# Altium project SteeringCircuit.PrjPcb
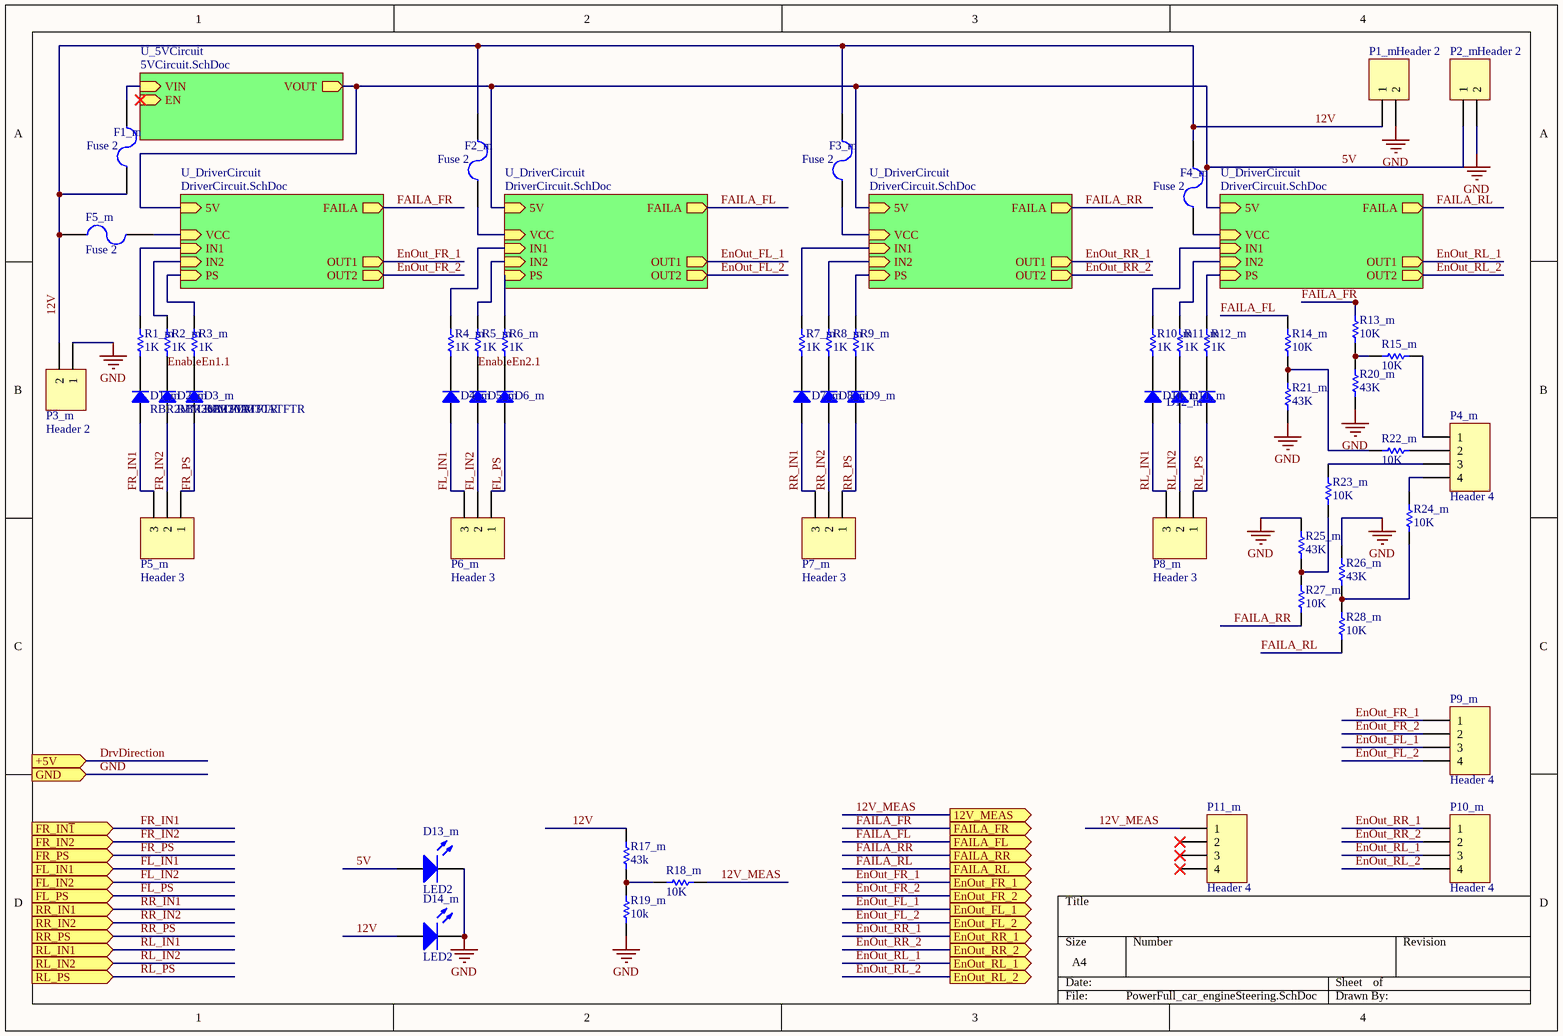
[diagram p0: PowerFull_car_engineSteering.SchDoc]
3 sheets, 93 parts. Net scope: hierarchical (ports join the sheet entries above them; power ports are global).
Board file: PCB.PcbDoc
Sheets:
  PowerFull_car_engineSteering.SchDoc
    U_DriverCircuit = DriverCircuit.SchDoc
    U_5VCircuit = 5VCircuit.SchDoc
    U_DriverCircuit = DriverCircuit.SchDoc
    U_DriverCircuit = DriverCircuit.SchDoc
    U_DriverCircuit = DriverCircuit.SchDoc

## Sheet PowerFull_car_engineSteering.SchDoc
size A4

### Parts
D1_m  RBR2MM30ATFTR  [SOD123F]
D2_m  RBR2MM30ATFTR  [SOD123F]
D3_m  RBR2MM30ATFTR  [SOD123F]
D4_m  RBR2MM30ATFTR  [SOD123F]  (value not drawn)
D5_m  RBR2MM30ATFTR  [SOD123F]  (value not drawn)
D6_m  RBR2MM30ATFTR  [SOD123F]  (value not drawn)
D7_m  RBR2MM30ATFTR  [SOD123F]  (value not drawn)
D8_m  RBR2MM30ATFTR  [SOD123F]  (value not drawn)
D9_m  RBR2MM30ATFTR  [SOD123F]  (value not drawn)
D10_m  RBR2MM30ATFTR  [SOD123F]  (value not drawn)
D11_m  RBR2MM30ATFTR  [SOD123F]  (value not drawn)
D12_m  RBR2MM30ATFTR  [SOD123F]  (value not drawn)
D13_m  LED2  [1608[0603]]
D14_m  LED2  [1608[0603]]
F1_m  Fuse 2  [1608[0603]]
F2_m  Fuse 2  [1608[0603]]
F3_m  Fuse 2  [1608[0603]]
F4_m  Fuse 2  [1608[0603]]
F5_m  Fuse 2  [1608[0603]]
P1_m  Header 2  [HDR1X2]
P2_m  Header 2  [HDR1X2]
P3_m  Header 2  [HDR1X2]
P4_m  Header 4  [HDR1X4]
P5_m  Header 3  [HDR1X3]
P6_m  Header 3  [HDR1X3]
P7_m  Header 3  [HDR1X3]
P8_m  Header 3  [HDR1X3]
P9_m  Header 4  [HDR1X4]
P10_m  Header 4  [HDR1X4]
P11_m  Header 4  [HDR1X4]
R1_m  value 1K  [1608[0603]]  (hidden comment: Res1)
R2_m  value 1K  [1608[0603]]  (hidden comment: Res1)
R3_m  value 1K  [1608[0603]]  (hidden comment: Res1)
R4_m  value 1K  [1608[0603]]  (hidden comment: Res1)
R5_m  value 1K  [1608[0603]]  (hidden comment: Res1)
R6_m  value 1K  [1608[0603]]  (hidden comment: Res1)
R7_m  value 1K  [1608[0603]]  (hidden comment: Res1)
R8_m  value 1K  [1608[0603]]  (hidden comment: Res1)
R9_m  value 1K  [1608[0603]]  (hidden comment: Res1)
R10_m  value 1K  [1608[0603]]  (hidden comment: Res1)
R11_m  value 1K  [1608[0603]]  (hidden comment: Res1)
R12_m  value 1K  [1608[0603]]  (hidden comment: Res1)
R13_m  value 10K  [1608[0603]]  (hidden comment: Res1)
R14_m  value 10K  [1608[0603]]  (hidden comment: Res1)
R15_m  value 10K  [1608[0603]]  (hidden comment: Res1)
R17_m  value 43k  [1608[0603]]  (hidden comment: Res1)
R18_m  value 10K  [1608[0603]]  (hidden comment: Res1)
R19_m  value 10k  [1608[0603]]  (hidden comment: Res1)
R20_m  value 43K  [1608[0603]]  (hidden comment: Res1)
R21_m  value 43K  [1608[0603]]  (hidden comment: Res1)
R22_m  value 10K  [1608[0603]]  (hidden comment: Res1)
R23_m  value 10K  [1608[0603]]  (hidden comment: Res1)
R24_m  value 10K  [1608[0603]]  (hidden comment: Res1)
R25_m  value 43K  [1608[0603]]  (hidden comment: Res1)
R26_m  value 43K  [1608[0603]]  (hidden comment: Res1)
R27_m  value 10K  [1608[0603]]  (hidden comment: Res1)
R28_m  value 10K  [1608[0603]]  (hidden comment: Res1)

### Sub-sheets
U_5VCircuit = 5VCircuit.SchDoc: VIN (in), EN (in), VOUT (out)
U_DriverCircuit = DriverCircuit.SchDoc: 5V (in), FAILA (out), PS (in), VCC (in), OUT1 (out), OUT2 (out), IN1 (in), IN2 (in)
U_DriverCircuit = DriverCircuit.SchDoc: 5V (in), FAILA (out), PS (in), VCC (in), OUT1 (out), OUT2 (out), IN1 (in), IN2 (in)
U_DriverCircuit = DriverCircuit.SchDoc: 5V (in), FAILA (out), PS (in), VCC (in), OUT1 (out), OUT2 (out), IN1 (in), IN2 (in)
U_DriverCircuit = DriverCircuit.SchDoc: 5V (in), FAILA (out), PS (in), VCC (in), OUT1 (out), OUT2 (out), IN1 (in), IN2 (in)

### Ports
12V_MEAS (out), +5V (in), EnOut_FL_1 (out), EnOut_FL_2 (out), EnOut_FR_1 (out), EnOut_FR_2 (out), EnOut_RL_1 (out), EnOut_RL_2 (out), EnOut_RR_1 (out), EnOut_RR_2 (out), FAILA_FL (out), FAILA_FR (out), FAILA_RL (out), FAILA_RR (out), FL_IN1 (in), FL_IN2 (in), FL_PS (in), FR_IN2 (in), FR_IN~{1} (in), FR_PS (in), GND (in), RL_IN1 (in), RL_IN2 (in), RL_PS (in), RR_IN1 (in), RR_IN2 (in), RR_PS (in)

### Nets
GND: D13_m.2(K) D14_m.2(K) P1_m.2 P2_m.2 P3_m.1 R19_m.1 R20_m.1 R21_m.1 R25_m.2 R26_m.2 ; port GND
5V: D13_m.1(A) P2_m.1 ; sheet U_DriverCircuit/5V, sheet U_5VCircuit/VOUT, sheet U_DriverCircuit/5V, sheet U_DriverCircuit/5V, sheet U_DriverCircuit/5V
12V: D14_m.1(A) F1_m.1 F2_m.2 F3_m.2 F4_m.2 F5_m.2 P1_m.1 P3_m.2 R17_m.2
12V_MEAS: P11_m.1 R18_m.1 ; port 12V_MEAS
DrvDirection: port +5V
EnableEn1.1: D2_m.2 R2_m.1
EnableEn2.1: D5_m.2 R5_m.1
EnOut_FL_1: P9_m.3 ; port EnOut_FL_1, sheet U_DriverCircuit/OUT1
EnOut_FL_2: P9_m.4 ; port EnOut_FL_2, sheet U_DriverCircuit/OUT2
EnOut_FR_1: P9_m.1 ; port EnOut_FR_1, sheet U_DriverCircuit/OUT1
EnOut_FR_2: P9_m.2 ; port EnOut_FR_2, sheet U_DriverCircuit/OUT2
EnOut_RL_1: P10_m.3 ; port EnOut_RL_1, sheet U_DriverCircuit/OUT1
EnOut_RL_2: P10_m.4 ; port EnOut_RL_2, sheet U_DriverCircuit/OUT2
EnOut_RR_1: P10_m.1 ; port EnOut_RR_1, sheet U_DriverCircuit/OUT1
EnOut_RR_2: P10_m.2 ; port EnOut_RR_2, sheet U_DriverCircuit/OUT2
FAILA_FL: R14_m.2 ; port FAILA_FL, sheet U_DriverCircuit/FAILA  [project net FAILA]
FAILA_FR: R13_m.2 ; port FAILA_FR, sheet U_DriverCircuit/FAILA  [project net FAILA]
FAILA_RL: R28_m.1 ; port FAILA_RL, sheet U_DriverCircuit/FAILA  [project net FAILA]
FAILA_RR: R27_m.1 ; port FAILA_RR, sheet U_DriverCircuit/FAILA  [project net FAILA]
FL_IN1: D4_m.1 P6_m.3 ; port FL_IN1
FL_IN2: D5_m.1 P6_m.2 ; port FL_IN2
FL_PS: D6_m.1 P6_m.1 ; port FL_PS
FR_IN1: D1_m.1 P5_m.3 ; port FR_IN~{1}
FR_IN2: D2_m.1 P5_m.2 ; port FR_IN2
FR_PS: D3_m.1 P5_m.1 ; port FR_PS
IN1: R4_m.2 ; sheet U_DriverCircuit/IN1
IN1: R7_m.2 ; sheet U_DriverCircuit/IN1  [a separate net that carries the same name]
IN1: R10_m.2 ; sheet U_DriverCircuit/IN1  [a separate net that carries the same name]
IN1: R1_m.2 ; sheet U_DriverCircuit/IN1  [a separate net that carries the same name]
IN2: R2_m.2 ; sheet U_DriverCircuit/IN2
IN2: R5_m.2 ; sheet U_DriverCircuit/IN2  [a separate net that carries the same name]
IN2: R8_m.2 ; sheet U_DriverCircuit/IN2  [a separate net that carries the same name]
IN2: R11_m.2 ; sheet U_DriverCircuit/IN2  [a separate net that carries the same name]
PS: R3_m.2 ; sheet U_DriverCircuit/PS
PS: R6_m.2 ; sheet U_DriverCircuit/PS  [a separate net that carries the same name]
PS: R9_m.2 ; sheet U_DriverCircuit/PS  [a separate net that carries the same name]
PS: R12_m.2 ; sheet U_DriverCircuit/PS  [a separate net that carries the same name]
RL_IN1: D10_m.1 P8_m.3 ; port RL_IN1
RL_IN2: D11_m.1 P8_m.2 ; port RL_IN2
RL_PS: D12_m.1 P8_m.1 ; port RL_PS
RR_IN1: D7_m.1 P7_m.3 ; port RR_IN1
RR_IN2: D8_m.1 P7_m.2 ; port RR_IN2
RR_PS: D9_m.1 P7_m.1 ; port RR_PS
VCC: F5_m.1 ; sheet U_DriverCircuit/VCC
VCC: F4_m.1 ; sheet U_DriverCircuit/VCC  [a separate net that carries the same name]
VCC: F3_m.1 ; sheet U_DriverCircuit/VCC  [a separate net that carries the same name]
VCC: F2_m.1 ; sheet U_DriverCircuit/VCC  [a separate net that carries the same name]
Net*1_5V_3: F1_m.2 ; sheet U_5VCircuit/VIN
NetD1_m_2: D1_m.2 R1_m.1
NetD3_m_2: D3_m.2 R3_m.1
NetD4_m_2: D4_m.2 R4_m.1
NetD6_m_2: D6_m.2 R6_m.1
NetD7_m_2: D7_m.2 R7_m.1
NetD8_m_2: D8_m.2 R8_m.1
NetD9_m_2: D9_m.2 R9_m.1
NetD10_m_2: D10_m.2 R10_m.1
NetD11_m_2: D11_m.2 R11_m.1
NetD12_m_2: D12_m.2 R12_m.1
NetP4_m_1: P4_m.1 R15_m.1
NetP4_m_2: P4_m.2 R22_m.1
NetP4_m_3: P4_m.3 R23_m.1
NetP4_m_4: P4_m.4 R24_m.1
NetR13_m_1: R13_m.1 R15_m.2 R20_m.2
NetR14_m_1: R14_m.1 R21_m.2 R22_m.2
NetR17_m_1: R17_m.1 R18_m.2 R19_m.2
NetR23_m_2: R23_m.2 R25_m.1 R27_m.2
NetR24_m_2: R24_m.2 R26_m.1 R28_m.2

Not connected (* = marked no-connect by the designer): P11_m 2* 3* 4*

### Library data of the parts
D1_m D2_m D3_m D4_m D5_m D6_m D7_m D8_m D9_m D10_m D11_m D12_m = RBR2MM30ATFTR: DIODE (RECTIFIER FRD) 30V-VR 2A-; Manufacturer: Rohm Semiconductor; Current - Average Rectified (Io): 2A; Current - Reverse Leakage @ Vr: 50µA @ 30V; Diode Type: Schottky; Speed: Fast Recovery =< 500ns, > 200mA (Io); Voltage - DC Reverse (Vr) (Max): 30V; Voltage - Forward (Vf) (Max) @ If: 530mV @ 2A; Part Number: RBR2MM30ATFTR; ComponentLink1Description: Datasheet; ComponentLink1URL: https://www.rohm.com/datasheet/RBR2MM30ATF/rbr2mm30atftr-e; ComponentLink2Description: DigiKey Link; ComponentLink2URL: http://digikey.com/product-detail/en/rohm-semiconductor/RBR2MM30ATFTR/RBR2MM30ATFCT-ND/9748240; LastUpdated: 02.09.2020 01:19:10; Lifecycle Status: Active; Minimum Order: 1; Mounting Type: Surface Mount; Operating Temperature - Junction: 150°C (Max); Package / Case: SOD-123F; Packaging: TapeAndReel; PartId: 2445; Part Status: Active; Price: 0.10; Series: Automotive, AEC-Q101; Supplier 1: DigiKey; Supplier Part Number 1: RBR2MM30ATFCT-ND; Supplier Device Package: PMDU
D13_m D14_m = LED2: Typical RED, GREEN, YELLOW, AMBER GaAs LED; Published: 8-Jun-2000; LatestRevisionDate: 17-Jul-2002; LatestRevisionNote: Re-released for DXP Platform.; PackageVersion: Feb-2002; PackageReference: 3.2X1.6X1.1; Publisher: Altium Limited; PackageDescription: SM LED; 2 Flat Leads
F1_m F2_m F3_m F4_m F5_m = Fuse 2: Fuse; Published: 8-Jun-2000; LatestRevisionDate: 17-Jul-2002; LatestRevisionNote: Re-released for DXP Platform.; PackageReference: PIN-W2/E2.8; Publisher: Altium Limited; PackageDescription: Thru-Hole; 2 Leads
P1_m P2_m P3_m = Header 2: Header, 2-Pin; LatestRevisionDate: 17-Jul-2002; LatestRevisionNote: Re-released for DXP Platform.; Publisher: Altium Limited
P4_m P9_m P10_m P11_m = Header 4: Header, 4-Pin; LatestRevisionDate: 17-Jul-2002; LatestRevisionNote: Re-released for DXP Platform.; Publisher: Altium Limited
P5_m P6_m P7_m P8_m = Header 3: Header, 3-Pin; LatestRevisionDate: 17-Jul-2002; LatestRevisionNote: Re-released for DXP Platform.; Publisher: Altium Limited
R1_m R2_m R3_m R4_m R5_m R6_m R7_m R8_m R9_m R10_m R11_m R12_m R13_m R14_m R15_m R17_m R18_m R19_m R20_m R21_m R22_m R23_m R24_m R25_m R26_m R27_m R28_m = Res1: Resistor; Published: 8-Jun-2000; LatestRevisionDate: 17-Jul-2002; LatestRevisionNote: Re-released for DXP Platform.; PackageReference: AXIAL-0.3; Publisher: Altium Limited; PackageDescription: Axial Device, Thru-Hole; 2 Leads; 0.3 in Pin Spacing

## Sheet DriverCircuit.SchDoc
size A4
Used 4 times, as channels U_DriverCircuit, U_DriverCircuit, U_DriverCircuit, U_DriverCircuit. Parts and nets are listed once, with the designators drawn on the sheet.
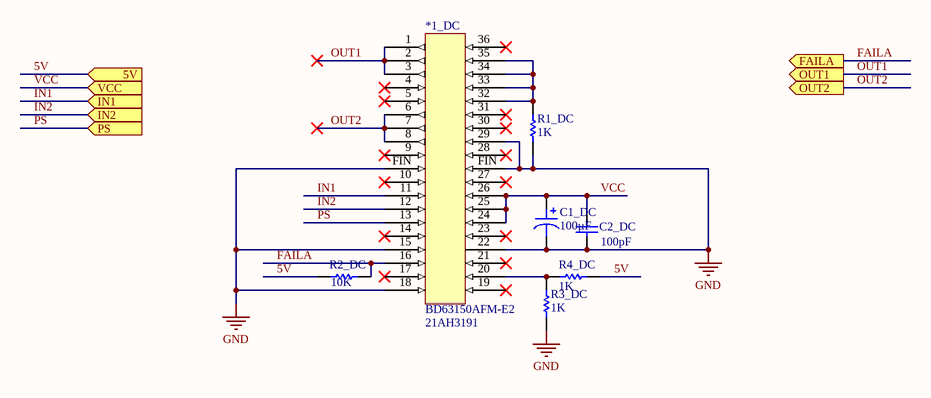
[diagram p1: DriverCircuit.SchDoc]

### Parts
*1_DC  BD63150AFM-E2  Supplier Part Number 1: 21AH3191  [Rohm_HSOP-M36_MFG]
C1_DC  100µF  [CAP ALSMD 6.6MM H6.1MM]
C2_DC  value 100pF  [1608[0603]]  (hidden comment: Cap)
R1_DC  value 1K  [1608[0603]]  (hidden comment: Res1)
R2_DC  value 10K  [1608[0603]]  (hidden comment: Res1)
R3_DC  value 1K  [1608[0603]]  (hidden comment: Res1)
R4_DC  value 1K  [1608[0603]]  (hidden comment: Res1)

### Ports
5V (in), FAILA (out), IN1 (in), IN2 (in), OUT1 (out), OUT2 (out), PS (in), VCC (in)

### Nets
GND: *1_DC.15 *1_DC.18 *1_DC.22 *1_DC.29 *1_DC.FIN C1_DC.2 C2_DC.1 R1_DC.2 R3_DC.2
5V: R2_DC.1 R4_DC.1 ; port 5V
FAILA: *1_DC.16 R2_DC.2 ; port FAILA
IN1: *1_DC.11 ; port IN1
IN2: *1_DC.12 ; port IN2
OUT1: *1_DC.1 *1_DC.2 *1_DC.3 ; port OUT1
OUT2: *1_DC.6 *1_DC.7 *1_DC.8 ; port OUT2
PS: *1_DC.13 ; port PS
VCC: *1_DC.24 *1_DC.25 *1_DC.26 C1_DC.1 C2_DC.2 ; port VCC
Net*1_DC_20: *1_DC.20 R3_DC.1 R4_DC.2
Net*1_DC_32: *1_DC.32 *1_DC.33 *1_DC.34 *1_DC.35 R1_DC.1

Not connected (* = marked no-connect by the designer): *1_DC 4* 5* 9* 10* 14* 17* 19* 21* 23* 27* 28* 30* 31* 36*

### Channels
U_DriverCircuit: designators *1_DC=FR C1_DC=C1#1 C2_DC=C2#1 R1_DC=R1#1 R2_DC=R2#1 R3_DC=R3#1 R4_DC=R4#1; ports 5V=5V FAILA=FAILA IN1=IN1 IN2=IN2 OUT1=EnOut_FR_1 OUT2=EnOut_FR_2 PS=PS VCC=VCC
U_DriverCircuit: designators *1_DC=FL C1_DC=C1#2 C2_DC=C2#2 R1_DC=R1#2 R2_DC=R2#2 R3_DC=R3#2 R4_DC=R4#2; ports 5V=5V FAILA=FAILA IN1=IN1 IN2=IN2 OUT1=EnOut_FL_1 OUT2=EnOut_FL_2 PS=PS VCC=VCC
U_DriverCircuit: designators *1_DC=RR C1_DC=C1#3 C2_DC=C2#3 R1_DC=R1#3 R2_DC=R2#3 R3_DC=R3#3 R4_DC=R4#3; ports 5V=5V FAILA=FAILA IN1=IN1 IN2=IN2 OUT1=EnOut_RR_1 OUT2=EnOut_RR_2 PS=PS VCC=VCC
U_DriverCircuit: designators *1_DC=RL C1_DC=C1#4 C2_DC=C2#4 R1_DC=R1#4 R2_DC=R2#4 R3_DC=R3#4 R4_DC=R4#4; ports 5V=5V FAILA=FAILA IN1=IN1 IN2=IN2 OUT1=EnOut_RL_1 OUT2=EnOut_RL_2 PS=PS VCC=VCC

### Library data of the parts
*1_DC = BD63150AFM-E2: DC Driver; Supplier 1: Newark
C1_DC = UWZ1A101MCL1GB: CAP ALUM 100UF 20% 10V SMD; Manufacturer: Nichicon; Lifetime @ Temp.: 1000 Hrs @ 105°C; Polarization: Polar; Ripple Current @ High Frequency: 90mA @ 10kHz; Ripple Current @ Low Frequency: 60mA @ 120Hz; Surface Mount Land Size: 0.260" L x 0.260" W (6.60mm x 6.60mm); Part Number: UWZ1A101MCL1GB; Applications: High Temperature Reflow; Capacitance: 100µF; ComponentLink1Description: Datasheet; ComponentLink1URL: http://nichicon-us.com/english/products/pdfs/e-uwz.pdf; ComponentLink2Description: DigiKey Link; ComponentLink2URL: http://digikey.com/product-detail/en/nichicon/UWZ1A101MCL1GB/493-9991-1-ND/3973963; Device Package: Radial, Can - SMD; Height - Seated (Max): 0.224" (5.70mm); LastUpdated: 02.09.2020 01:18:40; Lifecycle Status: Active; Minimum Order: 1; Mounting Type: Surface Mount; Operating Temperature: -55°C ~ 105°C; Package / Case: Radial, Can - SMD; Packaging: TapeAndReel; PartId: 9046; Part Status: Active; Price: 0.11; Series: UWZ; Size / Dimension: 0.248" Dia (6.30mm); Supplier 1: DigiKey; Supplier Part Number 1: 493-9991-1-ND; Tolerance: ±20%; Value: 100µF; Voltage - Rated: 10V
C2_DC = Cap: Capacitor; Published: 8-Jun-2000; LatestRevisionDate: 17-Jul-2002; LatestRevisionNote: Re-released for DXP Platform.; PackageReference: RAD-0.3; Publisher: Altium Limited; PackageDescription: Radial Cap, Thru-Hole; 2 Leads; 0.3 in Pin Spacing
R1_DC R2_DC R3_DC R4_DC = Res1: Resistor; Published: 8-Jun-2000; LatestRevisionDate: 17-Jul-2002; LatestRevisionNote: Re-released for DXP Platform.; PackageReference: AXIAL-0.3; Publisher: Altium Limited; PackageDescription: Axial Device, Thru-Hole; 2 Leads; 0.3 in Pin Spacing

## Sheet 5VCircuit.SchDoc
size A4
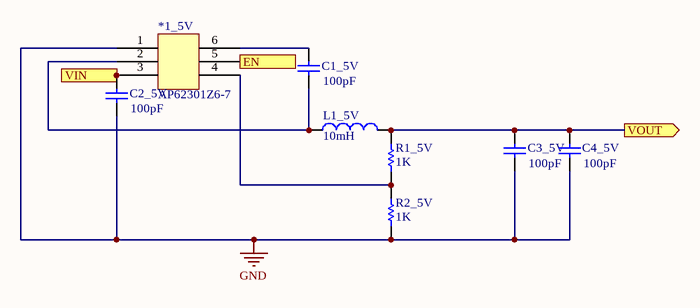
[diagram p2: 5VCircuit.SchDoc]

### Parts
*1_5V  AP62301Z6-7  [SOT-563-6]
C1_5V  value 100pF  [1608[0603]]  (hidden comment: Cap)
C2_5V  value 100pF  [1608[0603]]  (hidden comment: Cap)
C3_5V  value 100pF  [1608[0603]]  (hidden comment: Cap)
C4_5V  value 100pF  [1608[0603]]  (hidden comment: Cap)
L1_5V  value 10mH  [0402-A]  (hidden comment: Inductor)
R1_5V  value 1K  [1608[0603]]  (hidden comment: Res1)
R2_5V  value 1K  [1608[0603]]  (hidden comment: Res1)

### Ports
EN (in), VIN (in), VOUT (out)

### Nets
GND: *1_5V.1 C2_5V.1 C3_5V.1 C4_5V.1 R2_5V.2
5V: C3_5V.2 C4_5V.2 L1_5V.2 R1_5V.1 ; port VOUT
Net*1_5V_2: *1_5V.2 C1_5V.1 L1_5V.1
Net*1_5V_3: *1_5V.3 C2_5V.2 ; port VIN
Net*1_5V_4: *1_5V.4 R1_5V.2 R2_5V.1
Net*1_5V_5: *1_5V.5 ; port EN
Net*1_5V_6: *1_5V.6 C1_5V.2

### Library data of the parts
*1_5V = AP62301Z6-7: Switching Voltage Regulators DCDC Conv HV Buck SOT563 T&R 3K
C1_5V C2_5V C3_5V C4_5V = Cap: Capacitor; Published: 8-Jun-2000; LatestRevisionDate: 17-Jul-2002; LatestRevisionNote: Re-released for DXP Platform.; PackageReference: RAD-0.3; Publisher: Altium Limited; PackageDescription: Radial Cap, Thru-Hole; 2 Leads; 0.3 in Pin Spacing
L1_5V = Inductor: Code_IEC: 1005; Published: 8-Jun-2000; LatestRevisionDate: 29-May-2009; LatestRevisionNote: IPC-7351 Footprint Added.; PackageReference: 0402-A; Publisher: Altium Limited; PackageDescription: Chip Inductor; Code_JEITA: 0402
R1_5V R2_5V = Res1: Resistor; Published: 8-Jun-2000; LatestRevisionDate: 17-Jul-2002; LatestRevisionNote: Re-released for DXP Platform.; PackageReference: AXIAL-0.3; Publisher: Altium Limited; PackageDescription: Axial Device, Thru-Hole; 2 Leads; 0.3 in Pin Spacing

## Nets that join several sheets
GND: PowerFull_car_engineSteering (10 pins), U_DriverCircuit (9 pins), 5VCircuit (5 pins), U_DriverCircuit (9 pins), U_DriverCircuit (9 pins), U_DriverCircuit (9 pins)
5V: PowerFull_car_engineSteering (D13_m.1 P2_m.1), U_DriverCircuit (R2#1.1 R4#1.1), 5VCircuit (C3_5V.2 C4_5V.2 L1_5V.2 R1_5V.1), U_DriverCircuit (R2#2.1 R4#2.1), U_DriverCircuit (R2#3.1 R4#3.1), U_DriverCircuit (R2#4.1 R4#4.1)
EnOut_FL_1: PowerFull_car_engineSteering (P9_m.3), U_DriverCircuit (FL.1 FL.2 FL.3)
EnOut_FL_2: PowerFull_car_engineSteering (P9_m.4), U_DriverCircuit (FL.6 FL.7 FL.8)
EnOut_FR_1: PowerFull_car_engineSteering (P9_m.1), U_DriverCircuit (FR.1 FR.2 FR.3)
EnOut_FR_2: PowerFull_car_engineSteering (P9_m.2), U_DriverCircuit (FR.6 FR.7 FR.8)
EnOut_RL_1: PowerFull_car_engineSteering (P10_m.3), U_DriverCircuit (RL.1 RL.2 RL.3)
EnOut_RL_2: PowerFull_car_engineSteering (P10_m.4), U_DriverCircuit (RL.6 RL.7 RL.8)
EnOut_RR_1: PowerFull_car_engineSteering (P10_m.1), U_DriverCircuit (RR.1 RR.2 RR.3)
EnOut_RR_2: PowerFull_car_engineSteering (P10_m.2), U_DriverCircuit (RR.6 RR.7 RR.8)
FAILA: PowerFull_car_engineSteering (R14_m.2), U_DriverCircuit (FL.16 R2#2.2)
FAILA: PowerFull_car_engineSteering (R13_m.2), U_DriverCircuit (FR.16 R2#1.2)
FAILA: PowerFull_car_engineSteering (R27_m.1), U_DriverCircuit (R2#3.2 RR.16)
FAILA: PowerFull_car_engineSteering (R28_m.1), U_DriverCircuit (R2#4.2 RL.16)
IN1: PowerFull_car_engineSteering (R4_m.2), U_DriverCircuit (FL.11)
IN1: PowerFull_car_engineSteering (R7_m.2), U_DriverCircuit (RR.11)
IN1: PowerFull_car_engineSteering (R10_m.2), U_DriverCircuit (RL.11)
IN1: PowerFull_car_engineSteering (R1_m.2), U_DriverCircuit (FR.11)
IN2: PowerFull_car_engineSteering (R2_m.2), U_DriverCircuit (FR.12)
IN2: PowerFull_car_engineSteering (R5_m.2), U_DriverCircuit (FL.12)
IN2: PowerFull_car_engineSteering (R8_m.2), U_DriverCircuit (RR.12)
IN2: PowerFull_car_engineSteering (R11_m.2), U_DriverCircuit (RL.12)
Net*1_5V_3: PowerFull_car_engineSteering (F1_m.2), 5VCircuit (*1_5V.3 C2_5V.2)
PS: PowerFull_car_engineSteering (R3_m.2), U_DriverCircuit (FR.13)
PS: PowerFull_car_engineSteering (R6_m.2), U_DriverCircuit (FL.13)
PS: PowerFull_car_engineSteering (R9_m.2), U_DriverCircuit (RR.13)
PS: PowerFull_car_engineSteering (R12_m.2), U_DriverCircuit (RL.13)
VCC: PowerFull_car_engineSteering (F5_m.1), U_DriverCircuit (5 pins)
VCC: PowerFull_car_engineSteering (F4_m.1), U_DriverCircuit (5 pins)
VCC: PowerFull_car_engineSteering (F3_m.1), U_DriverCircuit (5 pins)
VCC: PowerFull_car_engineSteering (F2_m.1), U_DriverCircuit (5 pins)